# EAGLE design 0-30bfp (EAGLE 9.6.2)
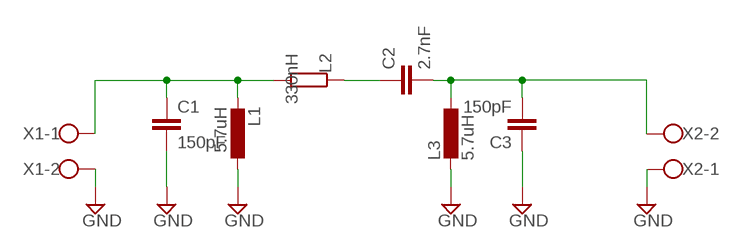
[diagram p0: schematic, sheet 1]

## Parts
C1  150pF  C-EUC1206K  [C1206K]
C2  2.7nF  C-EUC1206K  [C1206K]
C3  150pF  C-EUC1206K  [C1206K]
L1  5.7uH  L-EU0207/7  [0207/7]
L2  330nH  R-EU_R1206  [R1206]
L3  5.7uH  L-EU0207/7  [0207/7]
X1  W237-102  [W237-102]
X2  W237-102  [W237-102]

## Nets
GND: C1.2 C3.1 L1.1 L3.2 X1.2 X2.1
N$1: C1.1 L1.2 L2.2 X1.1
N$2: C2.1 L2.1
N$3: C2.2 C3.2 L3.1 X2.2

## Library data of the parts
C1-C3 = rcl:C-EU: CAPACITOR, European symbol; SPICEPREFIX: C
L1 L3 = rcl:L-EU: INDUCTOR, European symbol; SPICEPREFIX: L
L2 = rcl:R-EU_: RESISTOR, European symbol; SPICEPREFIX: R
X1 X2 = con-wago-500:W237-102: WAGO SCREW CLAMP; MPN: 237-102; OC_FARNELL: unknown; OC_NEWARK: 70K9898

## Board
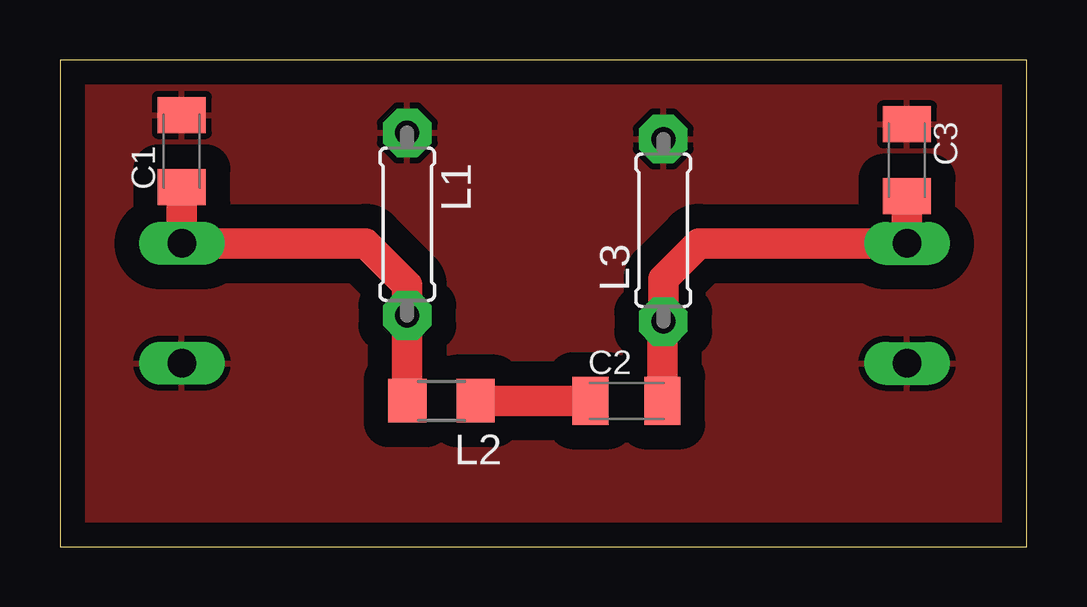
[diagram p1: board, top side]
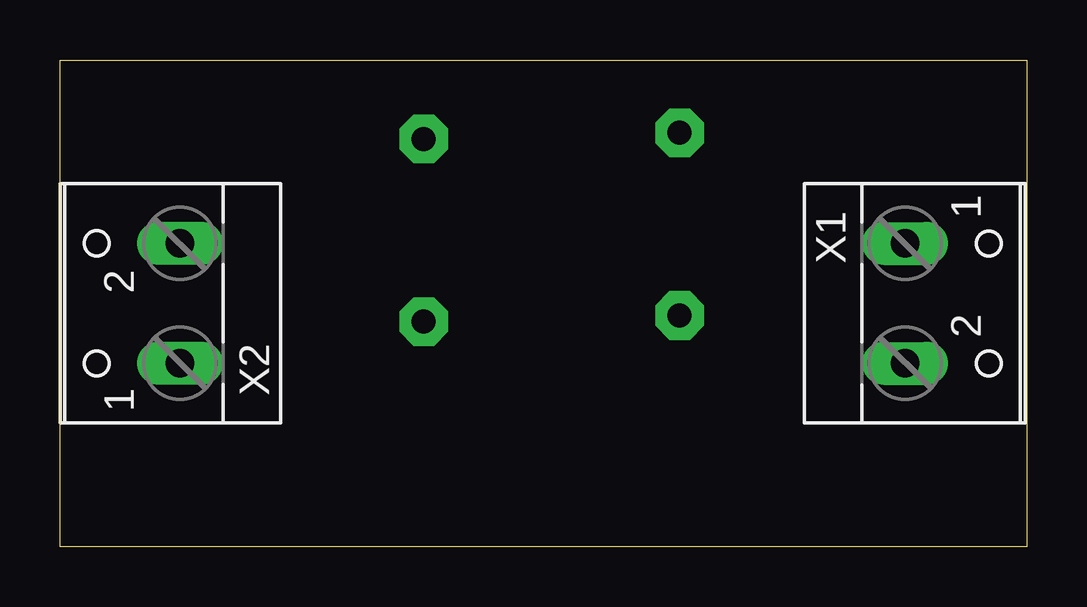
[diagram p2: board, bottom side, seen from below]

Size 40.31 x 20.31 mm. Coordinates in mm from the lower left corner, seen from the top.
Outline: 0,0 40.31,0 40.31,20.31 0,20.31 0,0
Copper layers (1*16): Top 0.035mm / dielectric 1.5mm / Bottom 0.035mm
Design rules "default": minimum track width 6mil, minimum drill 0.35mm, track to track 6mil, track to pad 6mil, pad to pad 6mil, via to via 6mil, smd to smd 6mil, copper to edge 40mil, drill to drill 6mil, minimum pad ring 10mil, minimum via ring 8mil, stop-mask expansion 4mil, vias tented up to drill 0mil, thermal gap 10mil

### Footprints (pad centres in the part's own frame; a part is rotated, then mirrored left to right if it is on the bottom)
C1206K = smd 1.5 x 2: 1 -1.5,0; 2 1.5,0
0207/7 = drill 1 pad 2.032 octagon: 1 -3.81,0; 2 3.81,0
R1206 = smd 1.6 x 1.803: 1 -1.422,0; 2 1.422,0
W237-102 = drill 1.194 long: 1 -2.5,-1.27; 2 2.5,-1.27

### Placement (x,y rotation side)
C1  5.08,16.51 90 top
C2  23.62,6.1 0 top
C3  35.31,16.13 270 top
L1  14.48,13.46 270 top
L2  15.9,6.1 180 top
L3  25.15,13.21 90 top
X1  3.81,10.16 270 bottom
X2  36.58,10.16 90 bottom

### Tracks (layer width: path | path; a pad name or v marks a point on that pad's centre or on a via)
GND
  pour Top (isolate 1.016): -1.27,31.75 -1.27,-1.02 39.62,-1.02 39.62,31.75
N$1
  Top 1.27: C1.1 X1.1 12.74,12.66 14.48,10.92 L1.2 L2.2
N$2
  Top 1.27: C2.1 L2.1
N$3
  Top 1.27: C3.2 X2.2 26.63,12.66 25.15,11.18 L3.1 25.12,9.37 C2.2